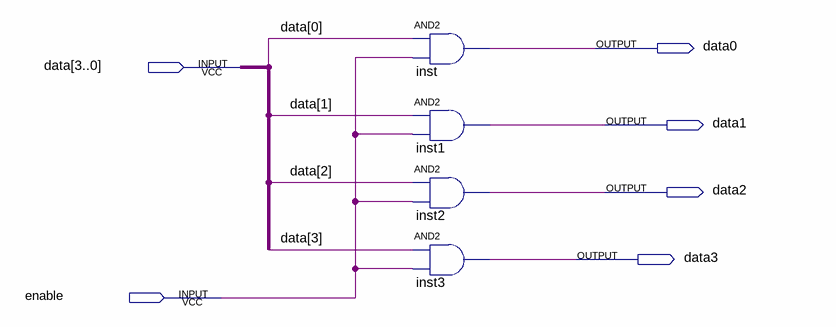
[diagram p0: schematic sheet]
// Quartus schematic splitter.bdf as structural Verilog: 4 symbols, 6 pins
module splitter (
  input  [3:0] data,
  input  enable,
  output data0,
  output data1,
  output data2,
  output data3
);

  and inst (data[0], data[0], enable);
  and inst1 (data[1], data[1], enable);
  and inst2 (data[2], data[2], enable);
  and inst3 (data[3], data[3], enable);

  assign data0 = data[0];
  assign data1 = data[1];
  assign data2 = data[2];
  assign data3 = data[3];
endmodule
